# Altium schematic sheet POWER.SchDoc
size A4
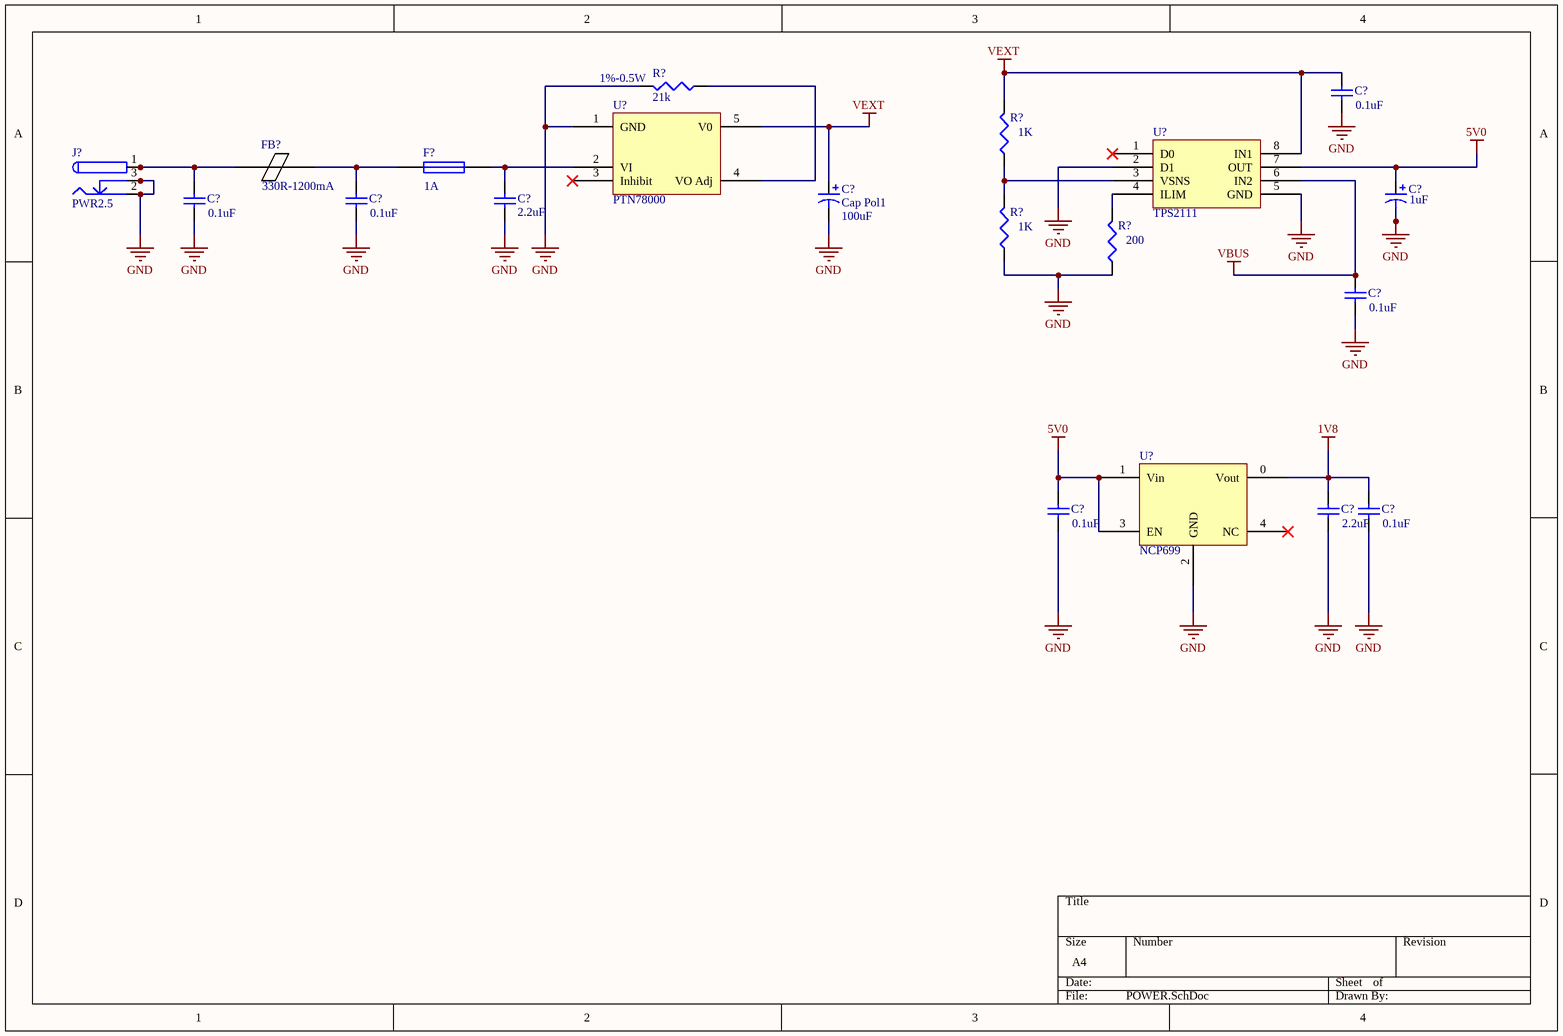
[diagram p0: POWER.SchDoc]

## Parts
(Parts that share a designator on the sheet are numbered #1, #2 ... from top to bottom, then left to right.)
C?#1  value 0.1uF  [RAD-0.3]
C?#2  value 2.2uF  [RAD-0.3]
C?#3  Cap Pol1  value 100uF  [RB7.6-15]
C?#4  value 1uF  [CAPC2012L]
C?#5  value 0.1uF  [RAD-0.3]
C?#6  value 0.1uF  [RAD-0.3]
C?#7  value 0.1uF  [RAD-0.3]
C?#8  value 0.1uF  [RAD-0.3]
C?#9  value 2.2uF  [RAD-0.3]
C?#10  value 0.1uF  [RAD-0.3]
F?  value 1A  [PIN-W2/E2.8]
FB?  330R-1200mA  [3-0603]
J?  PWR2.5  [KLD-0202]
R?#1  1%-0.5W  value 21k  [RESC1608L]
R?#2  value 1K  [RESC1608L]
R?#3  value 1K  [RESC1608L]
R?#4  value 200  [RESC1608L]
U?#1  PTN78000
U?#2  TPS2111  [TSOP65P640-8AL]
U?#3  NCP699  [SOT23-5AL]

## Nets
1V8: C?#9.2 C?#10.2 U?#3.0(Vout)
5V0: C?#4.1 C?#8.2 U?#2.7(OUT) U?#3.1(Vin) U?#3.3(EN)
GND: C?#1.1 C?#2.2 C?#3.2 C?#4.2 C?#5.1 C?#6.1 C?#7.1 C?#8.1 C?#9.1 C?#10.1 J?.2 J?.2A J?.2B J?.3 J?.3A J?.3B R?#1.2 R?#3.1 R?#4.1 U?#1.1(GND) U?#2.2(D1) U?#2.5(GND) U?#3.2(GND)
VBUS: C?#7.2 U?#2.6(IN2)
VEXT: C?#1.2 C?#3.1 R?#2.2 U?#1.5(V0) U?#2.8(IN1)
NetC?#2_1: C?#2.1 F?.2 U?#1.2(VI)
NetC?#5_2: C?#5.2 J?.1 J?.1A J?.1B
NetC?#6_2: C?#6.2 F?.1 FB?.1
NetR?#1_1: R?#1.1 U?#1.4(VO_Adj)
NetR?#2_1: R?#2.1 R?#3.2 U?#2.3(VSNS)
NetR?#4_2: R?#4.2 U?#2.4(ILIM)

Not connected (* = marked no-connect by the designer): FB? 2; U?#1 3(Inhibit)*; U?#2 1(D0)*; U?#3 4(NC)*

## Library data of the parts
C?#1 C?#2 C?#5-C?#10 = Cap: Capacitor; Published: 8-Jun-2000; LatestRevisionDate: 17-Jul-2002; LatestRevisionNote: Re-released for DXP Platform.; PackageReference: RAD-0.3; Publisher: Altium Limited
C?#3 = Cap Pol1: Polarized Capacitor (Radial); Published: 8-Jun-2000; LatestRevisionDate: 17-Jul-2002; LatestRevisionNote: Re-released for DXP Platform.; PackageReference: RB7.6-15; Publisher: Altium Limited
C?#4 = Cap Pol3: Polarized Capacitor (Surface Mount); Published: 8-Jun-2000; LatestRevisionDate: 29-May-2009; LatestRevisionNote: IPC-7351 Footprint Added.; PackageReference: C0805; Publisher: Altium Limited; PackageDescription: Chip Capacitor
F? = Fuse 1: Fuse; Published: 8-Jun-2000; LatestRevisionDate: 17-Jul-2002; LatestRevisionNote: Re-released for DXP Platform.; PackageReference: PIN-W2/E2.8; Publisher: Altium Limited
FB? = 300R-1200mA
J? = PWR2.5: Low Voltage Power Supply Connector; Published: 17-Dec-2003; DatasheetDocument: 09-May-2002; Publisher: Altium Limited; ComponentLink1Description: Manufacturer Link; ComponentLink1URL: http://domino.kycon.com/internet/Products.html
R?#1-R?#4 = Res3: Resistor; Published: 8-Jun-2000; LatestRevisionDate: 29-May-2009; LatestRevisionNote: IPC-7351 Footprint Added.; PackageReference: J1-0603; Publisher: Altium Limited; PackageDescription: Chip Resistor